# Altium schematic sheet ISL6236 DEMO.SchDoc
size A2
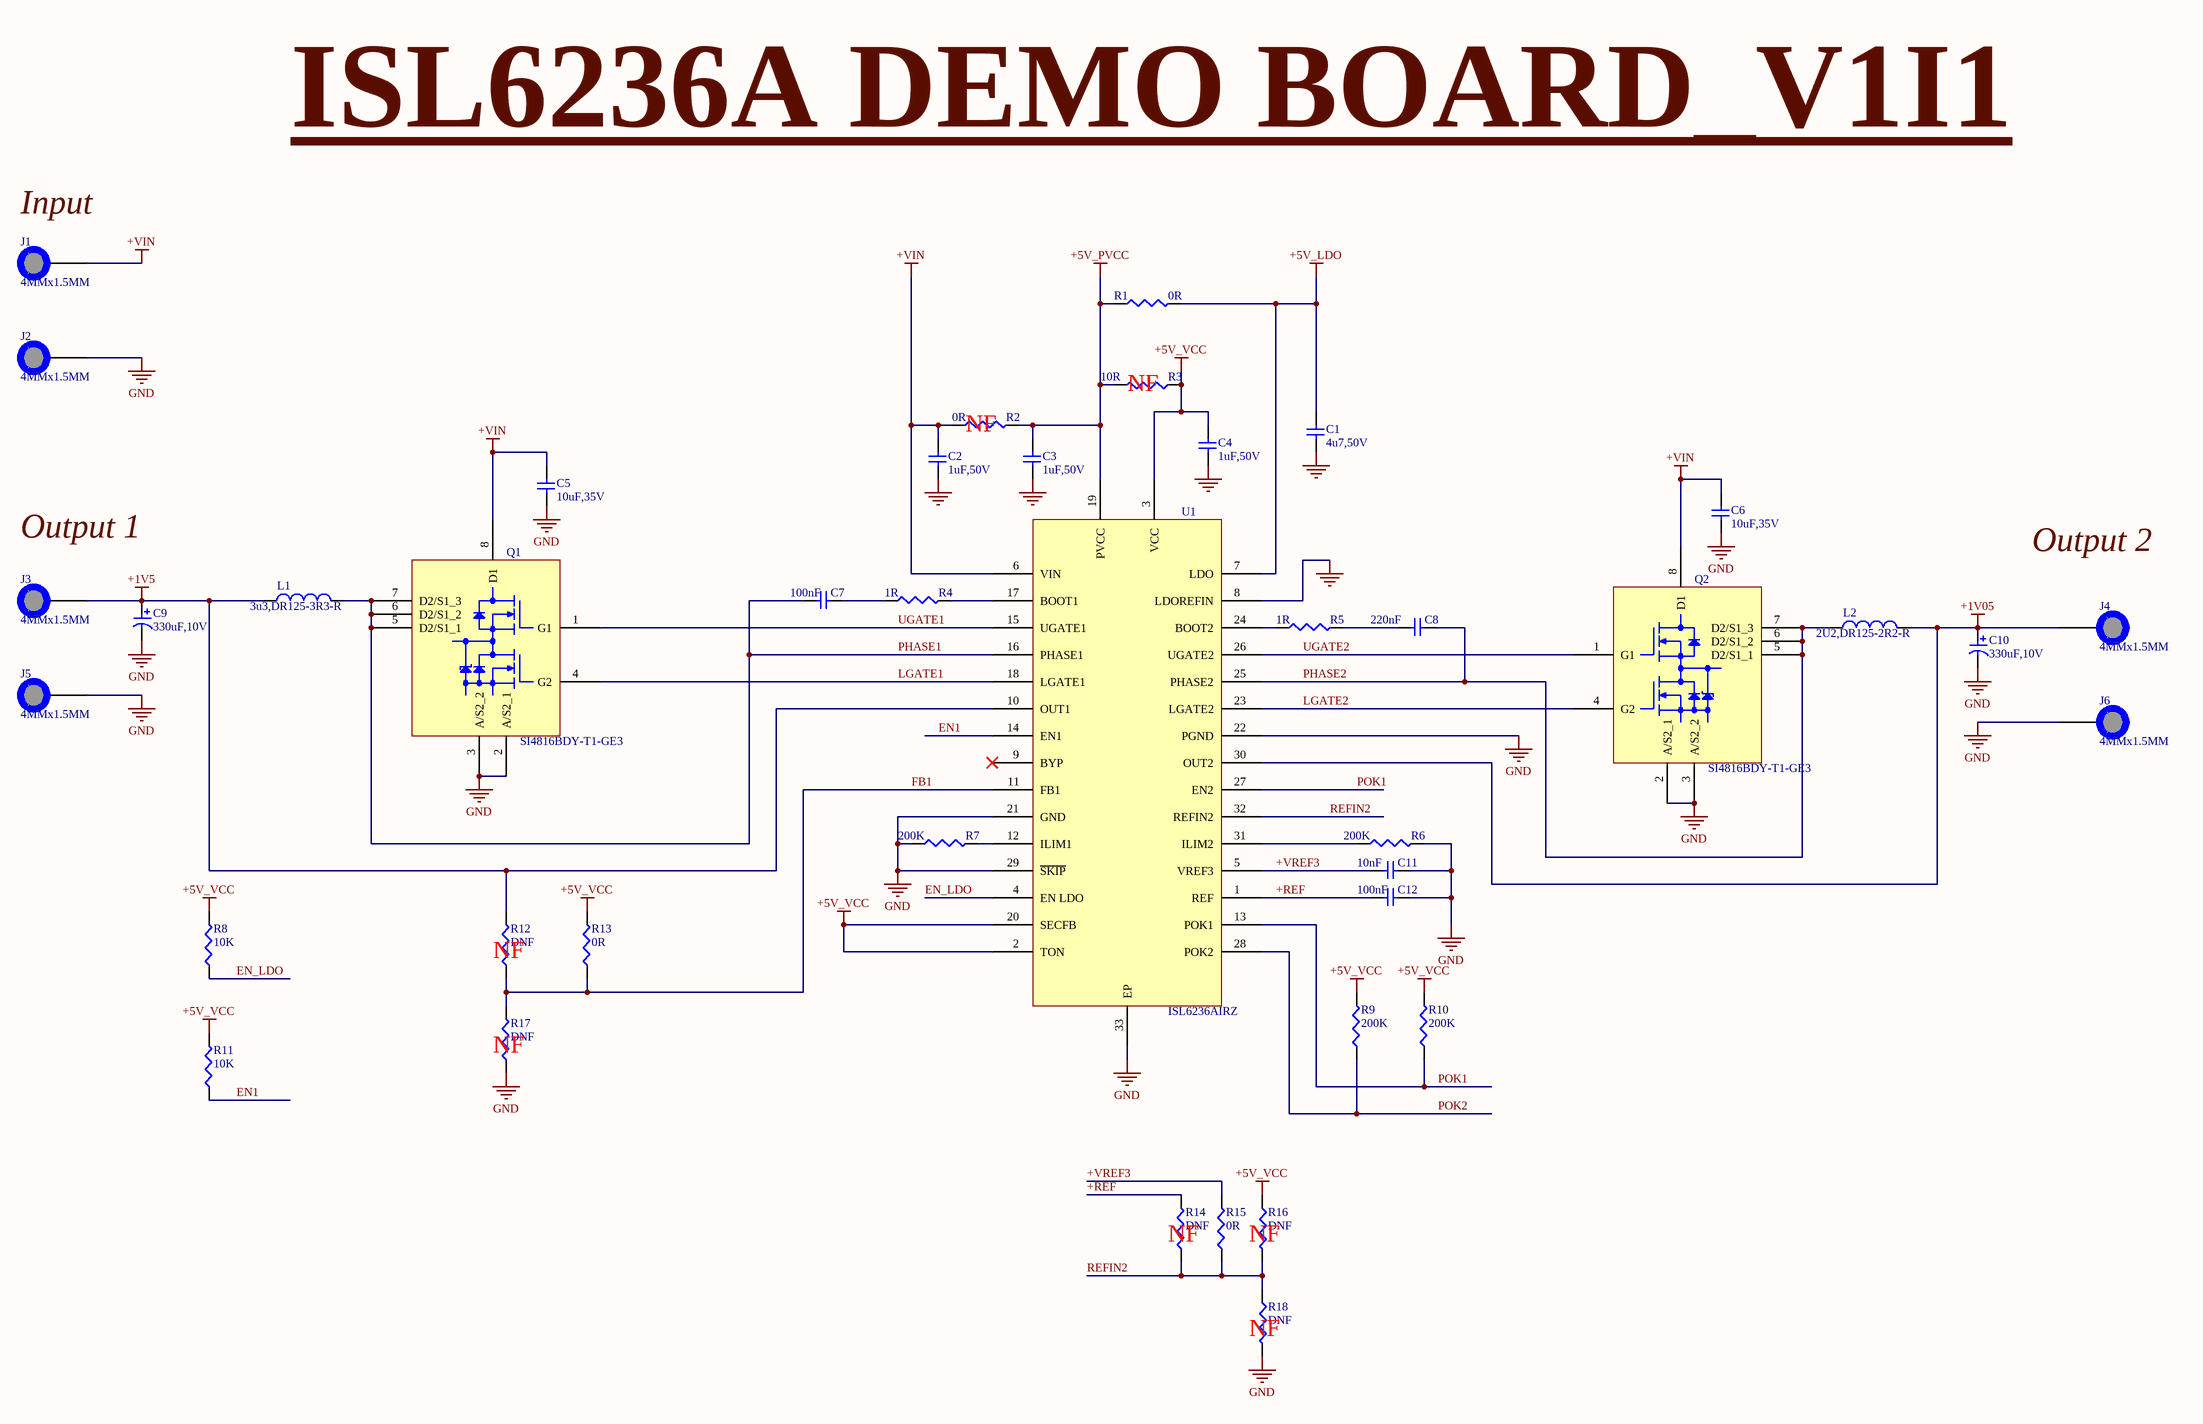
[diagram p0: ISL6236 DEMO.SchDoc]

## Parts
C1  4u7,50V  [C1206]
C2  1uF,50V  [C0805]
C3  1uF,50V  [C0805]
C4  1uF,50V  [C0805]
C5  10uF,35V  [C1210]
C6  10uF,35V  [C1210]
C7  100nF  [C0805]
C8  220nF  [C0805]
C9  330uF,10V  [7343-43]
C10  330uF,10V  [7343-43]
C11  10nF  [C0805]
C12  100nF  [C0805]
J1  4MMx1.5MM  [PAD_WITH_HOLE_4MMx1MM5]
J2  4MMx1.5MM  [PAD_WITH_HOLE_4MMx1MM5]
J3  4MMx1.5MM  [PAD_WITH_HOLE_4MMx1MM5]
J4  4MMx1.5MM  [PAD_WITH_HOLE_4MMx1MM5]
J5  4MMx1.5MM  [PAD_WITH_HOLE_4MMx1MM5]
J6  4MMx1.5MM  [PAD_WITH_HOLE_4MMx1MM5]
L1  3u3,DR125-3R3-R  [DR125]
L2  2U2,DR125-2R2-R  [DR125]
Q1  SI4816BDY-T1-GE3  [SO-8]
Q2  SI4816BDY-T1-GE3  [SO-8]
R1  0R  [R0805]
R2  0R  [R0805]
R3  10R  [R0805]
R4  1R  [R0805]
R5  1R  [R0805]
R6  200K  [R0805]
R7  200K  [R0805]
R8  10K  [R0805]
R9  200K  [R0805]
R10  200K  [R0805]
R11  10K  [R0805]
R12  DNF  [R0805]
R13  0R  [R0805]
R14  DNF  [R0805]
R15  0R  [R0805]
R16  DNF  [R0805]
R17  DNF  [R0805]
R18  DNF  [R0805]
U1  ISL6236AIRZ  [L32.5x5B]

## Nets
+1V5: C9.1 J3.1 L1.1 R12.2 U1.10(OUT1)
+1V05: C10.1 J4.1 L2.2 U1.30(OUT2)
+5V_LDO: C1.2 R1.2 U1.7(LDO)
+5V_PVCC: C3.2 R1.1 R2.2 R3.2 U1.19(PVCC)
+5V_VCC: C4.2 R3.1 R8.2 R9.2 R10.2 R11.2 R13.2 R16.1 U1.2(TON) U1.3(VCC) U1.20(SECFB)
+VIN: C2.2 C5.2 C6.2 J1.1 Q1.8(D1) Q2.8(D1) R2.1 U1.6(VIN)
GND: C1.1 C2.1 C3.1 C4.1 C5.1 C6.1 C9.2 C10.2 C11.2 C12.2 J2.1 J5.1 J6.1 Q1.2(A/S2_1) Q1.3(A/S2_2) Q2.2(A/S2_1) Q2.3(A/S2_2) R6.2 R7.1 R17.1 R18.2 U1.8(LDOREFIN) U1.21(GND) U1.22(PGND) U1.29(~{SKIP}) U1.33(EP)
+REF: C12.1 R14.2 U1.1(REF)
+VREF3: C11.1 R15.2 U1.5(VREF3)
EN1: R11.1 U1.14(EN1)
EN_LDO: R8.1 U1.4(EN_LDO)
FB1: R12.1 R13.1 R17.2 U1.11(FB1)
LGATE1: Q1.4(G2) U1.18(LGATE1)
LGATE2: Q2.4(G2) U1.23(LGATE2)
PHASE1: C7.1 L1.2 Q1.5(D2/S1_1) Q1.6(D2/S1_2) Q1.7(D2/S1_3) U1.16(PHASE1)
PHASE2: C8.2 L2.1 Q2.5(D2/S1_1) Q2.6(D2/S1_2) Q2.7(D2/S1_3) U1.25(PHASE2)
POK1: R10.1 U1.13(POK1) U1.27(EN2)
POK2: R9.1 U1.28(POK2)
REFIN2: R14.1 R15.1 R16.2 R18.1 U1.32(REFIN2)
UGATE1: Q1.1(G1) U1.15(UGATE1)
UGATE2: Q2.1(G1) U1.26(UGATE2)
NetC7_2: C7.2 R4.1
NetC8_1: C8.1 R5.2
NetR4_2: R4.2 U1.17(BOOT1)
NetR5_1: R5.1 U1.24(BOOT2)
NetR6_1: R6.1 U1.31(ILIM2)
NetR7_2: R7.2 U1.12(ILIM1)

Not connected (* = marked no-connect by the designer): U1 9(BYP)*

## Notes on the sheet
- ISL6236A DEMO BOARD_V1I1
- (near J1) Input
- (near R2) NF
- (near R3) NF
- Output 1
- Output 2
- (near R12) NF
- (near R17) NF
- (near R14) NF
- (near R16) NF
- (near R18) NF
- Title
- Size:
- Date:
- File:
- A2
- Number:
- Time:
- Revision:
- Sheet
- of

## Library data of the parts
C1 = C3216X5R1H475K160AB: C Series 1206 4.7 uF 50 V ±10 % Tolerance X5R SMT Multilayer Ceramic Capacitor; Manufacturer: TDK; Capacitance: 4.7uF; Tolerance: 10%; Mount: Surface Mount; Case/Package: 1206; Weight: 0.000571oz; Case Code (Imperial): 1206; Case Code (Metric): 3216; Dielectric Material: Ceramic; Min Operating Temperature: -55°C; Max Operating Temperature: 85°C; Packaging: Tape and Reel; Voltage Rating: 50V; Voltage Rating (DC): 50V; Package Quantity: 1; Dielectric: X5R; Termination: SMD/SMT; Composition: Ceramic; Length: 3.2mm; Height: 1.6mm; Width: 1.6mm; Thickness: 0.071inch; Depth: 1.6mm; Lead Free: Lead Free; ComponentLink1URL: http://www.mouser.com/ds/2/400/lcc_commercial_general_en-837201.pdf?src-supplier=Mouser; ComponentLink1Description: http://www.mouser.com/ds/2/400/lcc_commercial_general_en-837201.pdf?src-supplier=Mouser; ComponentLink2URL: https://product.tdk.com/en/products/common/pdf/mlcc_partnumber_description.pdf?src-supplier=Digi-Key; ComponentLink2Description: https://product.tdk.com/en/products/common/pdf/mlcc_partnumber_description.pdf?src-supplier=Digi-Key; ComponentLink3URL: https://product.tdk.com/info/en/documents/chara_sheet/C3216X5R1H475K160AB.pdf?src-supplier=Digi-Key; ComponentLink3Description: https://product.tdk.com/info/en/documents/chara_sheet/C3216X5R1H475K160AB.pdf?src-supplier=Digi-Key; Manufacturer Part Number: C3216X5R1H475K160AB; Pricing 1: 1=0.9, 10=0.664, 100=0.4554, 500=0.36052, 1000=0.3036 (USD); Stock 1: 2272; Supplier 1: Digi-Key; Supplier Part Number 1: 445-5994-6-ND
C2-C4 = C0805C105K5RACTU: CAP CER 1UF 50V X7R 0805; Manufacturer: KEMET; Dielectric Material: Ceramic; Tolerance: 10%; Mount: Surface Mount,PCB; Case/Package: 0805; Case Code (Metric): 2012; Case Code (Imperial): 0805; Contact Plating: Tin,Matte; Min Operating Temperature: -55°C; Max Operating Temperature: 125°C; Packaging: Tape and Reel; Capacitance: 1uF; Voltage Rating: 50V; Voltage Rating (DC): 50V; Package Quantity: 1; Dielectric: X7R; Termination: SMD/SMT; Voltage: 50V; Length: 2mm; Height: 1.25mm; Width: 0.049inch; Thickness: 0.055inch; Depth: 1.25mm; REACH SVHC: No SVHC; ComponentLink1URL: http://www.farnell.com/datasheets/2740426.pdf?src-supplier=Element14; ComponentLink1Description: http://www.farnell.com/datasheets/2740426.pdf?src-supplier=Element14; ComponentLink2URL: http://www.mouser.com/ds/2/212/KEM_C1002_X7R_SMD-1102033.pdf?src-supplier=Mouser; ComponentLink2Description: http://www.mouser.com/ds/2/212/KEM_C1002_X7R_SMD-1102033.pdf?src-supplier=Mouser; Manufacturer Part Number: C0805C105K5RACTU; Pricing 1: 1=0.4, 10=0.277, 100=0.1662, 500=0.12466, 1000=0.10527 (USD); Stock 1: 193296; Supplier 1: Digi-Key; Supplier Part Number 1: 399-7409-6-ND
C5 C6 = C1210C106K6PACTU: KEMET - C1210C106K6PACTU - SMD Multilayer Ceramic Capacitor, 10 µF, 35 V, 1210 [3225 Metric], ± 10%, X5R, C Series KEMET; Dissipation Factor: 2.5%; Manufacturer: KEMET; Mount: Surface Mount; Case/Package: 1210; Case Code (Metric): 3225; Case Code (Imperial): 1210; Dielectric Material: Ceramic; Min Operating Temperature: -55°C; Max Operating Temperature: 85°C; Packaging: Tape and Reel; Capacitance: 10uF; Voltage Rating: 35V; Voltage: 35V; Dielectric: X5R; Termination: Solder; Tolerance: 10%; Voltage Rating (DC): 35V; Length: 0.126inch; Height: 1.9mm; Width: 0.098inch; Thickness: 0.083inch; Depth: 2.5mm; Lead Free: Lead Free; ComponentLink1URL: http://www.farnell.com/datasheets/2741192.pdf?src-supplier=Farnell; ComponentLink1Description: http://www.farnell.com/datasheets/2741192.pdf?src-supplier=Farnell; ComponentLink2URL: https://api.kemet.com/component-edge/download/datasheet/C1210C106K6PAC7800.pdf?src-supplier=Digi-Key; ComponentLink2Description: https://api.kemet.com/component-edge/download/datasheet/C1210C106K6PAC7800.pdf?src-supplier=Digi-Key; ComponentLink3URL: http://www.kemet.com/docfinder?Partnumber=C1210C106K6PAC7800&src-supplier=Digi-Key; ComponentLink3Description: http://www.kemet.com/docfinder?Partnumber=C1210C106K6PAC7800&src-supplier=Digi-Key; ComponentLink4URL: http://www.alliedelec.com/m/d/f3c02ddb98afa3dd1adcb801109671e9.pdf?src-supplier=Allied+Electronics; ComponentLink4Description: http://www.alliedelec.com/m/d/f3c02ddb98afa3dd1adcb801109671e9.pdf?src-supplier=Allied+Electronics; ComponentLink5URL: http://www.farnell.com/datasheets/2741192.pdf?src-supplier=Newark; ComponentLink5Description: http://www.farnell.com/datasheets/2741192.pdf?src-supplier=Newark; Manufacturer Part Number: C1210C106K6PACTU; Pricing 1: 1=0.82, 10=0.603, 100=0.4138, 500=0.3276, 1000=0.27588 (USD); Stock 1: 40357; Supplier 1: Digi-Key; Supplier Part Number 1: 399-12070-6-ND
C7 C12 = C0805C104K5RACTU: Cap Ceramic 0.1uF 50V X7R 10% SMD 2.0 x 1.2 mm 125 C Paper T/R; Manufacturer: KEMET; Voltage: 500V; Mount: Surface Mount,PCB; Case/Package: 0805; Number of Pins: 2; Dielectric Material: Ceramic; Case Code (Imperial): 0805; Case Code (Metric): 2012; Contact Plating: Tin,Matte; Min Operating Temperature: -55°C; Max Operating Temperature: 125°C; Capacitance: 100nF; Tolerance: 10%; Packaging: Tape and Reel; Voltage Rating (DC): 50V; Dielectric: X7R; Termination: SMD/SMT; Package Quantity: 4000; Voltage Rating: 50V; Length: 2mm; Height: 0.9mm; Width: 1.2mm; Lead Pitch: 0.75mm; Depth: 1.25mm; Thickness: 0.035inch; Radiation Hardening: No; REACH SVHC: No SVHC; ComponentLink1URL: http://www.alliedelec.com/m/d/9bfe7773041ffe9d406e68bc7b377fdd.pdf?src-supplier=Allied+Electronics; ComponentLink1Description: http://www.alliedelec.com/m/d/9bfe7773041ffe9d406e68bc7b377fdd.pdf?src-supplier=Allied+Electronics; ComponentLink2URL: http://www.farnell.com/datasheets/2740684.pdf?src-supplier=Element14; ComponentLink2Description: http://www.farnell.com/datasheets/2740684.pdf?src-supplier=Element14; ComponentLink3URL: https://www.distrelec.biz/Web/Downloads/_t/ds/KEM_C1002_X7R_SMD_eng_tds.pdf?mime=application%2Fpdf&src-supplier=Distrelec; ComponentLink3Description: https://www.distrelec.biz/Web/Downloads/_t/ds/KEM_C1002_X7R_SMD_eng_tds.pdf?mime=application%2Fpdf&src-supplier=Distrelec; Manufacturer Part Number: C0805C104K5RACTU; Pricing 1: 1=0.17, 10=0.121, 100=0.0567, 500=0.03976, 1000=0.03291 (USD); Stock 1: 1647254; Supplier 1: Digi-Key; Supplier Part Number 1: 399-1170-6-ND
C8 = C0805C224K5RACTU: CAP CER 0.22UF 50V X7R 0805; Manufacturer: KEMET; Dielectric Material: Ceramic; Tolerance: 10%; Dissipation Factor: 2.5%; Mount: Surface Mount,PCB; Case/Package: 0805; Case Code (Metric): 2012; Case Code (Imperial): 0805; Min Operating Temperature: -55°C; Max Operating Temperature: 125°C; Package Quantity: 1; Capacitance: 220nF; Voltage Rating: 50V; Packaging: Tape and Reel; Voltage Rating (DC): 50V; Dielectric: X7R; Termination: SMD/SMT; Voltage: 50V; Length: 2mm; Height: 1.1mm; Width: 0.049inch; Thickness: 0.055inch; Lead Pitch: 0.75mm; Depth: 1.25mm; Radiation Hardening: No; REACH SVHC: No SVHC; ComponentLink1URL: http://www.kemet.com/kemet/web/homepage/kechome.nsf/vapubfiles/KEM_C1002_X7R_SMD.pdf/$file/KEM_C1002_X7R_SMD.pdf?src-supplier=Element14; ComponentLink1Description: http://www.kemet.com/kemet/web/homepage/kechome.nsf/vapubfiles/KEM_C1002_X7R_SMD.pdf/$file/KEM_C1002_X7R_SMD.pdf?src-supplier=Element14; ComponentLink2URL: https://www.verical.com/server-webapp/html/getDatasheet?partID=304413&src-supplier=Verical; ComponentLink2Description: https://www.verical.com/server-webapp/html/getDatasheet?partID=304413&src-supplier=Verical; ComponentLink3URL: http://www.farnell.com/datasheets/2739716.pdf?src-supplier=Element14; ComponentLink3Description: http://www.farnell.com/datasheets/2739716.pdf?src-supplier=Element14; ComponentLink4URL: https://search.kemet.com/component-edge/download/datasheet/C0805C224K5RACTU.pdf?src-supplier=Allied+Electronics; ComponentLink4Description: https://search.kemet.com/component-edge/download/datasheet/C0805C224K5RACTU.pdf?src-supplier=Allied+Electronics; Manufacturer Part Number: C0805C224K5RACTU; Pricing 1: 1=0.2, 10=0.139, 100=0.0655, 500=0.04592, 1000=0.03802 (USD); Stock 1: 1352987; Supplier 1: Digi-Key; Supplier Part Number 1: 399-3491-6-ND
C9 C10 = T530X337M010ATE004: Tantalum Capacitors - Polymer SMD 330uF 10volts 20%; Manufacturer: KEMET; Ripple Current: 8.2A; ESR (Equivalent Series Resistance): 4mR; Leakage Current: 330uA; Polarity: Polar; Dissipation Factor: 8%; Life (Hours): 2000Hour; Mount: Surface Mount,PCB; Case/Package: 2917; Case Code (Imperial): 2917; Case Code (Metric): 7343; Min Operating Temperature: -55°C; Max Operating Temperature: 125°C; Package Quantity: 500; Voltage Rating (DC): 10V; Capacitance: 330uF; Tolerance: 20%; Packaging: Tape and Reel; Voltage Rating: 10V; Termination: SMD/SMT; Voltage: 10V; Features: General Purpose; Length: 7.3mm; Height: 4mm; Width: 4.3mm; Height - Seated (Max): 0.169inch; Depth: 4.3mm; REACH SVHC: No SVHC; ComponentLink1URL: https://www.alliedelec.com/m/d/c2b5846d1b4015924ec44504ba06510b.pdf?src-supplier=Allied+Electronics; ComponentLink1Description: https://www.alliedelec.com/m/d/c2b5846d1b4015924ec44504ba06510b.pdf?src-supplier=Allied+Electronics; ComponentLink2URL: http://uk.rs-online.com/webdocs/1529/0900766b815291cb.pdf?src-supplier=RSComponents; ComponentLink2Description: http://uk.rs-online.com/webdocs/1529/0900766b815291cb.pdf?src-supplier=RSComponents; Manufacturer Part Number: T530X337M010ATE004; Pricing 1: 1=6.86, 10=6.095, 100=4.876 (USD); Stock 1: 3645; Supplier 1: Digi-Key; Supplier Part Number 1: 399-10378-6-ND
C11 = C0805F103K5RACTU: KEMET - C0805F103K5RACTU - SMD Multilayer Ceramic Capacitor, FO-CAP, 10000 pF, 50 V, 0805 [2012 Metric], ± 10%, X7R; Voltage Rating: 50V; Manufacturer: KEMET; Mount: Surface Mount; Case/Package: 0805; Number of Pins: 2; Case Code (Imperial): 0805; Case Code (Metric): 2012; Dielectric Material: Ceramic; Min Operating Temperature: -55°C; Max Operating Temperature: 125°C; Capacitance: 10nF; Package Quantity: 4000; Voltage Rating (DC): 50V; Tolerance: 10%; Packaging: Tape and Reel; Dielectric: X7R; Termination: SMD/SMT; Voltage: 50V; Length: 2mm; Height: 0.9mm; Width: 1.25mm; Lead Pitch: 0.75mm; Thickness: 0.039inch; Depth: 1.25mm; Radiation Hardening: No; REACH SVHC: No SVHC; ComponentLink1URL: https://search.kemet.com/component-edge/download/datasheet/C0805F103K5RACTU.pdf?src-supplier=Digi-Key; ComponentLink1Description: https://search.kemet.com/component-edge/download/datasheet/C0805F103K5RACTU.pdf?src-supplier=Digi-Key; ComponentLink2URL: http://www.farnell.com/datasheets/2739722.pdf?src-supplier=Element14; ComponentLink2Description: http://www.farnell.com/datasheets/2739722.pdf?src-supplier=Element14; Manufacturer Part Number: C0805F103K5RACTU; Pricing 1: 1=0.34, 10=0.236, 100=0.1417, 500=0.10624, 1000=0.08972 (USD); Stock 1: 98475; Supplier 1: Digi-Key; Supplier Part Number 1: 399-5107-6-ND
J1-J6 = PAD_WITH_HOLE_4MMx1MM5: Pad with a hole 4mm x 1.5mm
L1 = DR125-3R3-R: COILTRONICS         DR125-3R3-R             Surface Mount Power Inductor, DR Series, 3.3 H, 9.26 A, 12.7 A, Shielded; Manufacturer: Eaton Coiltronics; Core Material: Ferrite; Tolerance: 20%; Inductance: 3.3uH; Max DC Current: 12.7A; DC Resistance (DCR): 6.3mR; Test Frequency: 100kHz; RMS Current (Irms): 9.26A; Mount: Surface Mount; Case/Package: 0125; Number of Pins: 2; Weight: 0.144oz; Min Operating Temperature: -40°C; Max Operating Temperature: 125°C; Packaging: Tape and Reel; Shielding: Shielded; Inductance Tolerance: 20%; Package Quantity: 600; Termination: SMD/SMT; Military Standard: Not; Saturation Current: 12.7A; Self Resonant Frequency: 100kHz; Length: 12.5mm; Height: 6mm; Width: 12.5mm; Depth: 12.5mm; Radiation Hardening: No; REACH SVHC: No SVHC; Lead Free: Lead Free; ComponentLink1URL: http://www.farnell.com/datasheets/87246.pdf?src-supplier=Element14; ComponentLink1Description: http://www.farnell.com/datasheets/87246.pdf?src-supplier=Element14; Manufacturer Part Number: DR125-3R3-R; Pricing 1: 1=2.03, 10=1.873, 100=1.3113 (USD); Stock 1: 1635; Supplier 1: Digi-Key; Supplier Part Number 1: 513-1529-6-ND
L2 = DR125-2R2-R: FIXED IND 2.2UH 10.9A 4.5 MOHM; Manufacturer: Eaton Cooper; Core Material: Ferrite; Saturation Current: 15A; Tolerance: 20%; Shielding: Shielded; DC Resistance (DCR): 4.5mR; Test Frequency: 100kHz; Mount: Surface Mount; Case/Package: Nonstandard; Number of Pins: 2; Weight: 0.144oz; Min Operating Temperature: -40°C; Max Operating Temperature: 125°C; Package Quantity: 600; Current Rating: 10.9A; Packaging: Tape and Reel; Inductance: 2.2uH; Inductance Tolerance: 20%; Composition: Wirewound; Max DC Current: 10.9A; Termination: SMD/SMT; Self Resonant Frequency: 100kHz; DC Current: 10.9A; Military Standard: Not; RMS Current (Irms): 10.9A; Length: 12.5mm; Height: 6mm; Width: 0.492inch; Height - Seated (Max): 0.236inch; Depth: 12.5mm; Radiation Hardening: No; REACH SVHC: No SVHC; Lead Free: Lead Free; ComponentLink1URL: https://www.verical.com/server-webapp/html/getDatasheet?partID=571249&src-supplier=Verical; ComponentLink1Description: https://www.verical.com/server-webapp/html/getDatasheet?partID=571249&src-supplier=Verical; ComponentLink2URL: http://uk.rs-online.com/webdocs/116a/0900766b8116a153.pdf?src-supplier=RSComponents; ComponentLink2Description: http://uk.rs-online.com/webdocs/116a/0900766b8116a153.pdf?src-supplier=RSComponents; ComponentLink3URL: http://www.farnell.com/datasheets/87246.pdf?src-supplier=Element14; ComponentLink3Description: http://www.farnell.com/datasheets/87246.pdf?src-supplier=Element14; Pricing 1: 1=2.03, 10=1.873, 100=1.3113 (USD); Manufacturer Part Number: DR125-2R2-R; Stock 1: 508; Supplier 1: Digi-Key; Supplier Part Number 1: 513-1662-6-ND
Q1 Q2 = SI4816BDY-T1-GE3: MOSFET 2N-CH 30V 5.8A 8-SOIC; Manufacturer: Vishay Siliconix; Rise Time: 9ns; Rds On Max: 18.5mR; Gate to Source Voltage (Vgs): 20V; Drain to Source Resistance: 9.3mR; Max Power Dissipation: 1.25W; Turn-Off Delay Time: 31ns; Turn-On Delay Time: 13ns; Number of Elements: 2; Threshold Voltage: 3V; FET Type: 2 N-Channel; Mount: Surface Mount; Case/Package: SO; Number of Pins: 8; Weight: 0.006596oz; Contact Plating: Tin,Matte; Min Operating Temperature: -55°C; Max Operating Temperature: 150°C; Packaging: Tape and Reel; Package Quantity: 1; Drain to Source Voltage (Vdss): 30V; Continuous Drain Current (ID): 5.8A; Fall Time: 9ns; Number of Channels: 2; On-State Resistance: 18.5mR; Length: 5mm; Height: 1.55mm; Width: 4mm; Radiation Hardening: No; REACH SVHC: No SVHC; Lead Free: Lead Free; ComponentLink1URL: http://www.farnell.com/datasheets/1911984.pdf?src-supplier=Element14; ComponentLink1Description: http://www.farnell.com/datasheets/1911984.pdf?src-supplier=Element14; ComponentLink2URL: http://www.farnell.com/datasheets/2049212.pdf?src-supplier=Element14; ComponentLink2Description: http://www.farnell.com/datasheets/2049212.pdf?src-supplier=Element14; ComponentLink3URL: http://www.vishay.com/docs/73026/si4816bd.pdf?src-supplier=Future+Electronics; ComponentLink3Description: http://www.vishay.com/docs/73026/si4816bd.pdf?src-supplier=Future+Electronics; ComponentLink4URL: http://www.vishay.com/docs/73026/si4816bd.pdf?src-supplier=Digi-Key; ComponentLink4Description: http://www.vishay.com/docs/73026/si4816bd.pdf?src-supplier=Digi-Key; ComponentLink5URL: http://www.vishay.com/docs/73026/si4816bd.pdf?src-supplier=Avnet; ComponentLink5Description: http://www.vishay.com/docs/73026/si4816bd.pdf?src-supplier=Avnet; ComponentLink6URL: http://datasheet.iiic.cc/vishay_[siliconix]/SI4816BDY-T1-GE3.pdf?src-supplier=IIIC; ComponentLink6Description: http://datasheet.iiic.cc/vishay_[siliconix]/SI4816BDY-T1-GE3.pdf?src-supplier=IIIC; Manufacturer Part Number: SI4816BDY-T1-GE3; Pricing 1: 1=1.56, 10=1.405, 25=1.3252, 100=1.0335, 250=1.007, 500=0.8745, 1000=0.742 (USD); Stock 1: 4612; Supplier 1: Digi-Key; Supplier Part Number 1: SI4816BDY-T1-GE3DKR-ND
R1 R2 R13 R15 = AC0805JR-070RL: Thick Film Resistors - SMD 1/8W 0.0ohm 5%; Manufacturer: Yageo; Power Rating: 125mW; Voltage Rating: 150V; Resistance: 0mR; Temperature Coefficient: 200ppm/°C; Case/Package: 0805; Case Code (Imperial): 0805; Case Code (Metric): 2012; Min Operating Temperature: -55°C; Max Operating Temperature: 155°C; Packaging: Tape and Reel; Tolerance: 5%; Composition: Thick Film; Termination: SMD/SMT; Number of Terminations: 2; Max Power Dissipation: 125mW; Features: Moisture Resistant,Automotive AEC-Q200; Length: 0.079inch; Height: 0.024inch; Width: 1.25mm; Lead Free: Lead Free; ComponentLink1URL: http://www.yageo.com/documents/recent/PYu-AC_51_RoHS_L_2.pdf?src-supplier=Mouser; ComponentLink1Description: http://www.yageo.com/documents/recent/PYu-AC_51_RoHS_L_2.pdf?src-supplier=Mouser; ComponentLink2URL: http://www.yageo.com/NewPortal/yageodocoutput?fileName=/pdf/R-Chip/PYu-AC_51_RoHS_L_6.pdf&src-supplier=Digi-Key; ComponentLink2Description: http://www.yageo.com/NewPortal/yageodocoutput?fileName=/pdf/R-Chip/PYu-AC_51_RoHS_L_6.pdf&src-supplier=Digi-Key; Manufacturer Part Number: AC0805JR-070RL; Pricing 1: 1=0.1, 10=0.041, 25=0.0296, 50=0.0226, 100=0.0167, 250=0.01272, 500=0.01018, 1000=0.0075 (USD); Stock 1: 15680; Supplier 1: Digi-Key; Supplier Part Number 1: YAG3755DKR-ND
R3 = AC0805FR-0710RL: Res Thick Film 0805 10 Ohm 1% 0.125W(1/8W) ±200ppm/C Sulfur Resistant Molded SMD Automotive Paper T/R; Manufacturer: Yageo; Power Rating: 125mW; Voltage Rating: 150V; Temperature Coefficient: 200ppm/°C; Case/Package: 0805; Case Code (Imperial): 0805; Case Code (Metric): 2012; Min Operating Temperature: -55°C; Max Operating Temperature: 155°C; Packaging: Tape and Reel; Resistance: 10R; Tolerance: 1%; Composition: Thick Film; Termination: SMD/SMT; Number of Terminations: 2; Military Standard: Not; Max Power Dissipation: 125mW; Features: Moisture Resistant,Automotive AEC-Q200; Length: 2mm; Height: 0.024inch; Width: 1.25mm; Depth: 1.25mm; Lead Free: Lead Free; ComponentLink1URL: http://www.mouser.com/ds/2/447/yageodocoutput-1111992.pdf?src-supplier=Mouser; ComponentLink1Description: http://www.mouser.com/ds/2/447/yageodocoutput-1111992.pdf?src-supplier=Mouser; ComponentLink2URL: http://www.yageo.com/NewPortal/yageodocoutput?fileName=/pdf/R-Chip/PYu-AC_51_RoHS_L_6.pdf&src-supplier=Digi-Key; ComponentLink2Description: http://www.yageo.com/NewPortal/yageodocoutput?fileName=/pdf/R-Chip/PYu-AC_51_RoHS_L_6.pdf&src-supplier=Digi-Key; ComponentLink3URL: http://www.yageo.com/documents/recent/PYu-AC_51_RoHS_L_2_revised.pdf?src-supplier=Future+Electronics; ComponentLink3Description: http://www.yageo.com/documents/recent/PYu-AC_51_RoHS_L_2_revised.pdf?src-supplier=Future+Electronics; ComponentLink4URL: http://components.arrow.com/part/dataview/0323_03350463?src-supplier=Arrow+Europe; ComponentLink4Description: http://components.arrow.com/part/dataview/0323_03350463?src-supplier=Arrow+Europe; Manufacturer Part Number: AC0805FR-0710RL; Pricing 1: 1=0.1, 10=0.086, 100=0.0333, 1000=0.01463, 2500=0.01264 (USD); Stock 1: 0; Supplier 1: Digi-Key; Supplier Part Number 1: YAG3690DKR-ND
R4 R5 = AC0805FR-071RL: RES SMD 1 OHM 1% 1/8W 0805; Manufacturer: Yageo; Voltage Rating: 150V; Power Rating: 125mW; Temperature Coefficient: 200ppm/°C; Case/Package: 0805; Weight: 0.000194oz; Case Code (Imperial): 0805; Case Code (Metric): 2012; Min Operating Temperature: -55°C; Max Operating Temperature: 155°C; Packaging: Tape and Reel; Tolerance: 1%; Resistance: 1R; Composition: Thick Film; Number of Terminations: 2; Termination: SMD/SMT; Max Power Dissipation: 125mW; Features: Moisture Resistant,Automotive AEC-Q200; Length: 0.079inch; Height: 0.024inch; Width: 0.049inch; Lead Free: Lead Free; ComponentLink1URL: http://www.mouser.com/ds/2/447/yageodocoutput-1111992.pdf?src-supplier=Mouser; ComponentLink1Description: http://www.mouser.com/ds/2/447/yageodocoutput-1111992.pdf?src-supplier=Mouser; Manufacturer Part Number: AC0805FR-071RL; Pricing 1: 1=0.1, 10=0.086, 100=0.0333, 1000=0.01463, 2500=0.01264 (USD); Stock 1: 16410; Supplier 1: Digi-Key; Supplier Part Number 1: YAG3705DKR-ND
R6 R7 R9 R10 = AC0805FR-07200KL: Res Thick Film 0805 200K Ohm 1% 0.125W(1/8W) ±100ppm/C Epoxy Pad SMD Automotive T/R; Manufacturer: Yageo; Power Rating: 125mW; Resistance: 200kR; Voltage Rating: 150V; Temperature Coefficient: 100ppm/°C; Case/Package: 0805; Case Code (Imperial): 0805; Case Code (Metric): 2012; Min Operating Temperature: -55°C; Max Operating Temperature: 155°C; Tolerance: 1%; Packaging: Tape and Reel; Composition: Thick Film; Number of Terminations: 2; Termination: SMD/SMT; Max Power Dissipation: 125mW; Features: Moisture Resistant,Automotive AEC-Q200; Length: 0.079inch; Height: 0.024inch; Width: 0.049inch; Lead Free: Lead Free; ComponentLink1URL: http://www.yageo.com/NewPortal/yageodocoutput?fileName=/pdf/R-Chip/PYu-AC_51_RoHS_L_6.pdf&src-supplier=Digi-Key; ComponentLink1Description: http://www.yageo.com/NewPortal/yageodocoutput?fileName=/pdf/R-Chip/PYu-AC_51_RoHS_L_6.pdf&src-supplier=Digi-Key; ComponentLink2URL: http://www.yageo.com/documents/recent/PYu-AC_51_RoHS_L_2.pdf?src-supplier=Future+Electronics; ComponentLink2Description: http://www.yageo.com/documents/recent/PYu-AC_51_RoHS_L_2.pdf?src-supplier=Future+Electronics; ComponentLink3URL: http://www.mouser.com/ds/2/447/yageodocoutput-1111992.pdf?src-supplier=Mouser; ComponentLink3Description: http://www.mouser.com/ds/2/447/yageodocoutput-1111992.pdf?src-supplier=Mouser; Manufacturer Part Number: AC0805FR-07200KL; Pricing 1: 1=0.1, 10=0.048, 100=0.0197, 1000=0.00885, 2500=0.00768 (USD); Stock 1: 15718; Supplier 1: Digi-Key; Supplier Part Number 1: YAG3706DKR-ND
R8 R11 = AC0805FR-0710KL: RES SMD 10K OHM 1% 1/8W 0805; Manufacturer: Yageo; Resistance: 10kR; Power Rating: 125mW; Voltage Rating: 150V; Temperature Coefficient: 100ppm/°C; Case/Package: 0805; Case Code (Metric): 2012; Case Code (Imperial): 0805; Min Operating Temperature: -55°C; Max Operating Temperature: 155°C; Packaging: Tape and Reel; Tolerance: 1%; Package Quantity: 1; Composition: Thick Film; Number of Terminations: 2; Termination: SMD/SMT; Military Standard: Not; Max Power Dissipation: 125mW; Features: Moisture Resistant,Automotive AEC-Q200,Anti-Sulfur; Length: 0.079inch; Height: 0.024inch; Width: 0.049inch; Depth: 1.25mm; Lead Free: Lead Free; ComponentLink1URL: http://www.yageo.com/NewPortal/yageodocoutput?fileName=/pdf/R-Chip/PYu-AC_51_RoHS_L_6.pdf&src-supplier=Mouser; ComponentLink1Description: http://www.yageo.com/NewPortal/yageodocoutput?fileName=/pdf/R-Chip/PYu-AC_51_RoHS_L_6.pdf&src-supplier=Mouser; Manufacturer Part Number: AC0805FR-0710KL; Pricing 1: 1=0.1, 10=0.048, 100=0.0197, 1000=0.00885, 2500=0.00768 (USD); Stock 1: 552255; Supplier 1: Digi-Key; Supplier Part Number 1: 311-10KLGDKR-ND
R12 R14 R16-R18 = RES
U1 = ISL6236AIRZ: IC MAIN PWR CTRLR QUAD 32-QFN; Manufacturer: Intersil; Number of Outputs: 2; Output Current: 20A; Switching Frequency: 500kHz; Mount: Surface Mount; Case/Package: QFN; Min Operating Temperature: -40°C; Max Operating Temperature: 100°C; Packaging: Rail/Tube; Package Quantity: 60; Length: 5mm; Height: 0.95mm; Width: 5mm; Radiation Hardening: No; Lead Free: Lead Free; ComponentLink1URL: http://www.intersil.com/content/dam/Intersil/documents/isl6/isl6236a.pdf?src-supplier=Avnet+Europe; ComponentLink1Description: http://www.intersil.com/content/dam/Intersil/documents/isl6/isl6236a.pdf?src-supplier=Avnet+Europe; Supplier Part Number 1: ISL6236AIRZ-ND; Supplier 1: Digi-Key; Stock 1: 0; Pricing 1: 600=3.68 (USD); Manufacturer Part Number: ISL6236AIRZ